# Altium schematic sheet PROC054D_SMA_SMP_Connectors.SchDoc: SMA_SMP_CONNECTORS
size 558 x 431 mm; Date: Not shown in title block; ApprovedBy: Not shown in title block; CheckedBy: Not shown in title block; Author: Not shown in title block; CompanyName: Not shown in title block; DrawnBy: a0271760; Engineer: Not shown in title block; Organization: Not shown in title block; Address1: Not shown in title block; Address2: Not shown in title block; Address3: Not shown in title block; Address4: Not shown in title block; DocumentNumber: 15; Revision: Use project pAWRameter SCH_Rev; SheetNumber: 15; SheetTotal: 19; PageSetup: Record=PageOptions|CenterHorizontal=True|CenterVertical=True|PrintScale=1.00|XCorrection=1.00|YCorrection=1.00|PrintKind=0|BorderSize=5000000|LeftOffset=0|BottomOffset=0|Orientation=2|PaperLength=1000|PaperWidth=1000|Scale=100|PaperSource=15|PrintQuality=600|MediaType=1|DitherType=10|PaperKind=Letter|PrintScaleMode=1; CurrentTime: Not shown in title block; CurrentDate: Not shown in title block; Time: Not shown in title block; DocumentFullPathAndName: Not shown in title block; DocumentName: Not shown in title block; ModifiedDate: Not shown in title block; ImagePath: Not shown in title block
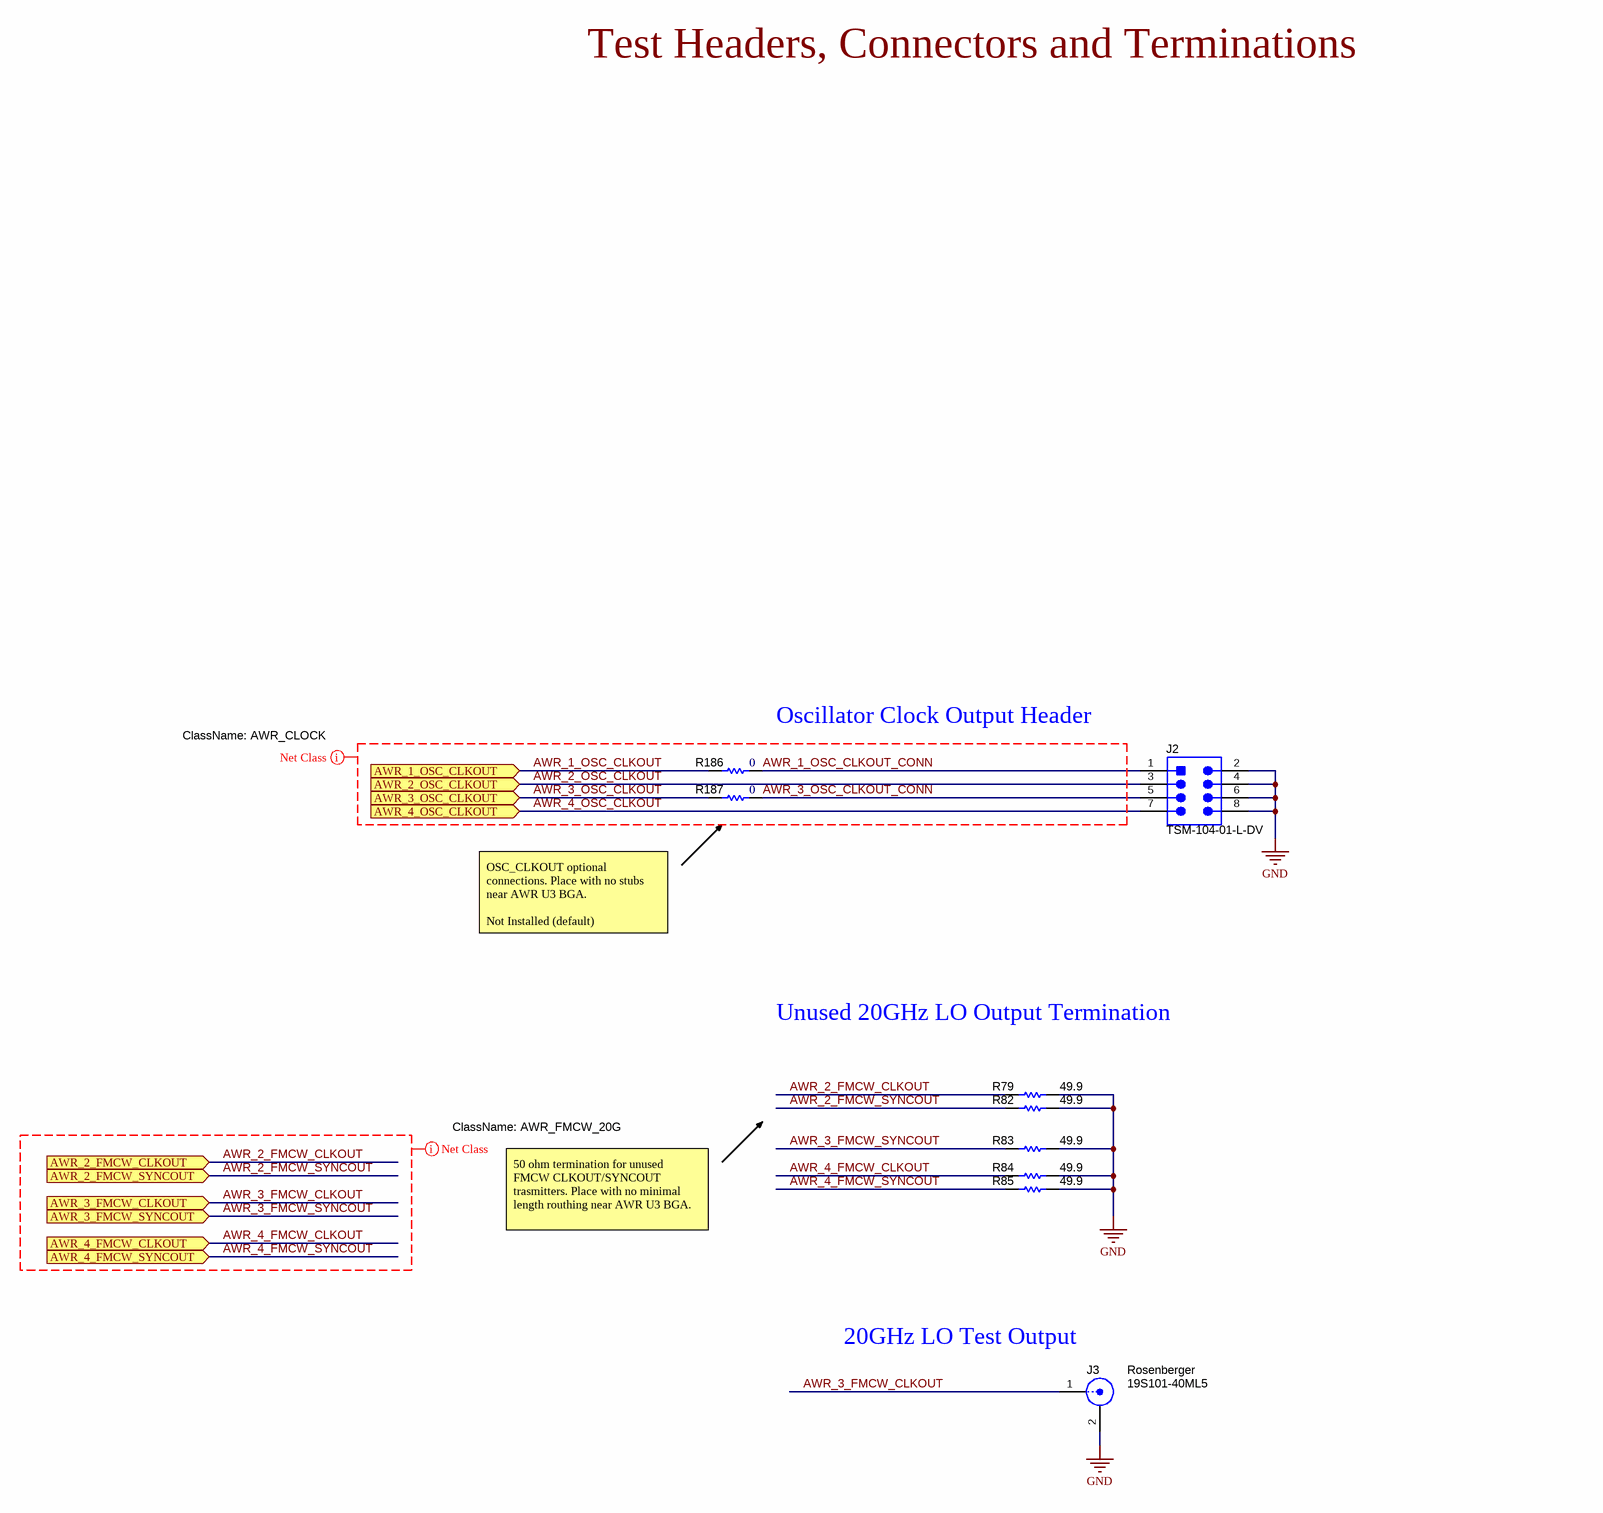
[diagram p0: PROC054D_SMA_SMP_Connectors.SchDoc]

## Parts
J2  TSM-104-01-L-DV  [Samtec_TSM-104-01-x-DV]
J3  19S101-40ML5  Manufacturer: Rosenberger  [19S101_40ML5]
R79  ValueDisplayed: 49.9  [0402]  (hidden comment: CRCW040249R9FKED)
R82  ValueDisplayed: 49.9  [0402]  (hidden comment: CRCW040249R9FKED)
R83  ValueDisplayed: 49.9  [0402]  (hidden comment: CRCW040249R9FKED)
R84  ValueDisplayed: 49.9  [0402]  (hidden comment: CRCW040249R9FKED)
R85  ValueDisplayed: 49.9  [0402]  (hidden comment: CRCW040249R9FKED)
R186  ValueDisplayed: 0  [0402S]  (hidden comment: ERJ-2GE0R00X)
R187  ValueDisplayed: 0  [0402S]  (hidden comment: ERJ-2GE0R00X)

## Ports
AWR_1_OSC_CLKOUT (in), AWR_2_FMCW_CLKOUT (in), AWR_2_FMCW_SYNCOUT (in), AWR_2_OSC_CLKOUT (in), AWR_3_FMCW_CLKOUT (in), AWR_3_FMCW_SYNCOUT (in), AWR_3_OSC_CLKOUT (in), AWR_4_FMCW_CLKOUT (in), AWR_4_FMCW_SYNCOUT (in), AWR_4_OSC_CLKOUT (in)

## Nets
GND: J2.2 J2.4 J2.6 J2.8 J3.2 R79.2 R82.2 R83.2 R84.2 R85.2
AWR_1_OSC_CLKOUT: R186.1 ; port AWR_1_OSC_CLKOUT
AWR_1_OSC_CLKOUT_CONN: J2.1 R186.2
AWR_2_FMCW_CLKOUT: R79.1 ; port AWR_2_FMCW_CLKOUT
AWR_2_FMCW_SYNCOUT: R82.1 ; port AWR_2_FMCW_SYNCOUT
AWR_2_OSC_CLKOUT: J2.3 ; port AWR_2_OSC_CLKOUT
AWR_3_FMCW_CLKOUT: J3.1 ; port AWR_3_FMCW_CLKOUT
AWR_3_FMCW_SYNCOUT: R83.1 ; port AWR_3_FMCW_SYNCOUT
AWR_3_OSC_CLKOUT: R187.1 ; port AWR_3_OSC_CLKOUT
AWR_3_OSC_CLKOUT_CONN: J2.5 R187.2
AWR_4_FMCW_CLKOUT: R84.1 ; port AWR_4_FMCW_CLKOUT
AWR_4_FMCW_SYNCOUT: R85.1 ; port AWR_4_FMCW_SYNCOUT
AWR_4_OSC_CLKOUT: J2.7 ; port AWR_4_OSC_CLKOUT

## Layout directives
net class AWR_FMCW_20G: AWR_2_FMCW_CLKOUT, AWR_2_FMCW_SYNCOUT, AWR_3_FMCW_CLKOUT, AWR_3_FMCW_SYNCOUT, AWR_4_FMCW_CLKOUT, AWR_4_FMCW_SYNCOUT
net class AWR_CLOCK: AWR_1_OSC_CLKOUT, AWR_1_OSC_CLKOUT_CONN, AWR_2_OSC_CLKOUT, AWR_3_OSC_CLKOUT, AWR_3_OSC_CLKOUT_CONN, AWR_4_OSC_CLKOUT

## Notes on the sheet
- Test Headers, Connectors and Terminations
- Oscillator Clock Output Header
- OSC_CLKOUT optional connections. Place with no stubs near AWR U3 BGA.
  Not Installed (default)
- Unused 20GHz LO Output Termination
- 50 ohm termination for unused FMCW CLKOUT/SYNCOUT trasmitters. Place with no minimal length routhing near AWR U3 BGA.
- (near J3) 20GHz LO Test Output
- Drawn By:
- SVN Rev:
- Number:
- TID #:
- Orderable:
- Rev:
- Sheet Title:
- File:
- Project Title:
- Designed for:
- Assembly VAWRiant:
- Mod. Date:
- Sheet:
- Size:
- of
- C
- http://www.ti.com
- Texas Instruments and/or its licensors do not wAWRrant the accuracy or completeness of this specification or any information contained therein. Texas Instruments and/or its licensors do not wAWRrant that this design will meet the specifications, will be suitable for your application or fit for any pAWRticulAWR purpose, or will operate in an implementation. Texas Instruments and/or its licensors do not wAWRrant that the design is production worthy. You should completely validate and test your design implementation to confirm the system functionality for your application.
- Engineer:
- Contact:
- © Texas Instruments

## Library data of the parts
J2 = CMP-0075593-2: Header, 2.54mm, 4x2, Gold, SMT; Manufacturer: Samtec; Pitch_mm: 2.54; Gender: Male; Cert_CSA: Y; Green_REACh: Passed; Current_A: 4.9A; Voltage_V: 475V; Shrouded: N; Green_Lifecycle: Active; Row_Count: 2; ComponentLink1Description: Datasheet URL; RoHS: Y; Supplier Part Number 3: 1803506; Supplier 1: Digi-Key; Cert_UL: Y; Orientation: Vertical; Green_EU RoHS: Passed; PackageReference: Header, 2.54mm, 4x2, SMT; Color: Black; PartNumber: TSM-104-01-L-DV; PinCount: 8; Supplier Part Number 2: 77P5924; ContactFinish: Gold; Supplier 2: Newark; ClassName: Header; RowSpacing_mm: 2.54; ComponentLink1URL: https://www.samtec.com/ftppub/cpdf/TSM-1XX-XX-XXX-XX-X-XXX-X-MKT.pdf; CompType: Header; MountType: SMT; Supplier Part Number 1: TSM-104-01-L-DV-ND; Supplier 3: Farnell; Green_EU RoHS-2: Passed
J3 = CMP-0055458-1: Connector, RF 50 Ohms, SMT; CT: FALSE; ComponentLink1URL: https://sps06.itg.ti.com/sites/KMS/crossdivteams/altium/docs/ComponentDatasheets/hd19S101-40ML5_e[1].pdf; Publisher: Texas Instruments; CompType: Connector; PackageReference: 5.2x4.1x5.2 mm; LatestRevisionDate: 26/05/2017; RoHS: Y; CNHeader: FALSE; MountType: SMT; PartNumber: 19S101-40ML5; ComponentLink1Description: Datasheet URL
R79 R82-R85 = CMP-0026404-2: RES, 49.9, 1%, 0.063 W, AEC-Q200 Grade 0, 0402; Manufacturer: Vishay-Dale; Power_W: 63mW; TempCo: 100 ppm/C; Value_Code: 49R9; Value: 49.9; EIA_Code: E96; SizeX_mm: 1; SizeY_mm: 0.5; SizeZ_mm: 0.6; Value2: 0.063W; AEC Qualified: Y; VDC_V: 50V; AEC Category: Q200; AEC Grade: 0; ComponentLink1URL: http://www.vishay.com/docs/20035/dcrcwe3.pdf; Supplier Part Number 2: 52K7114; Supplier 2: Newark; Supplier Part Number 3: 71-CRCW0402-49.9-E3; Supplier 3: Mouser; RoHS: E; Value1: 1%; MountType: SMT; Supplier 1: Digi-Key; PackageReference: 0402; Tolerance_%: 1%; Res_ohm: 49.9; SizeArea_mm2: 0.5; CompType: Resistor; PartNumber: CRCW040249R9FKED; ComponentLink1Description: Datasheet link; Supplier Part Number 1: 541-49.9LCT-ND; Technology: Thick Film
R186 R187 = CMP-0026992-3: RES, 0, 5%, 0.1 W, AEC-Q200 Grade 0, 0402; Manufacturer: Panasonic; Power_W: 100mW; TempCo: 600 ppm/C; Value_Code: 0000; Value: 0; EIA_Code: E24; SizeX_mm: 1; SizeY_mm: 0.5; SizeZ_mm: 0.6; Value2: 0.1W; AEC Qualified: Y; VDC_V: 50V; AEC Category: Q200; SizeAreaWB_mm2: 3; Supplier Part Number 2: 65T8307; Supplier 2: Newark; Supplier Part Number 3: 667-ERJ-2GE0R00X; Supplier 3: Mouser; RoHS: Y; Value1: 5%; MountType: SMT; Supplier 1: Digi-Key; PackageReference: 0402; Tolerance_%: 5%; Res_ohm: 0; SizeArea_mm2: 0.5; CompType: Resistor; PartNumber: ERJ-2GE0R00X; ComponentLink1Description: Datasheet link; Supplier Part Number 1: P0.0JCT-ND; Technology: Thick Film; ComponentLink1URL: https://industrial.panasonic.com/cdbs/www-data/pdf/RDA0000/AOA0000C301.pdf; AEC Grade: 0